# Altium schematic sheet Core.SchDoc
size A3; SheetNumber: 1; SheetTotal: 4
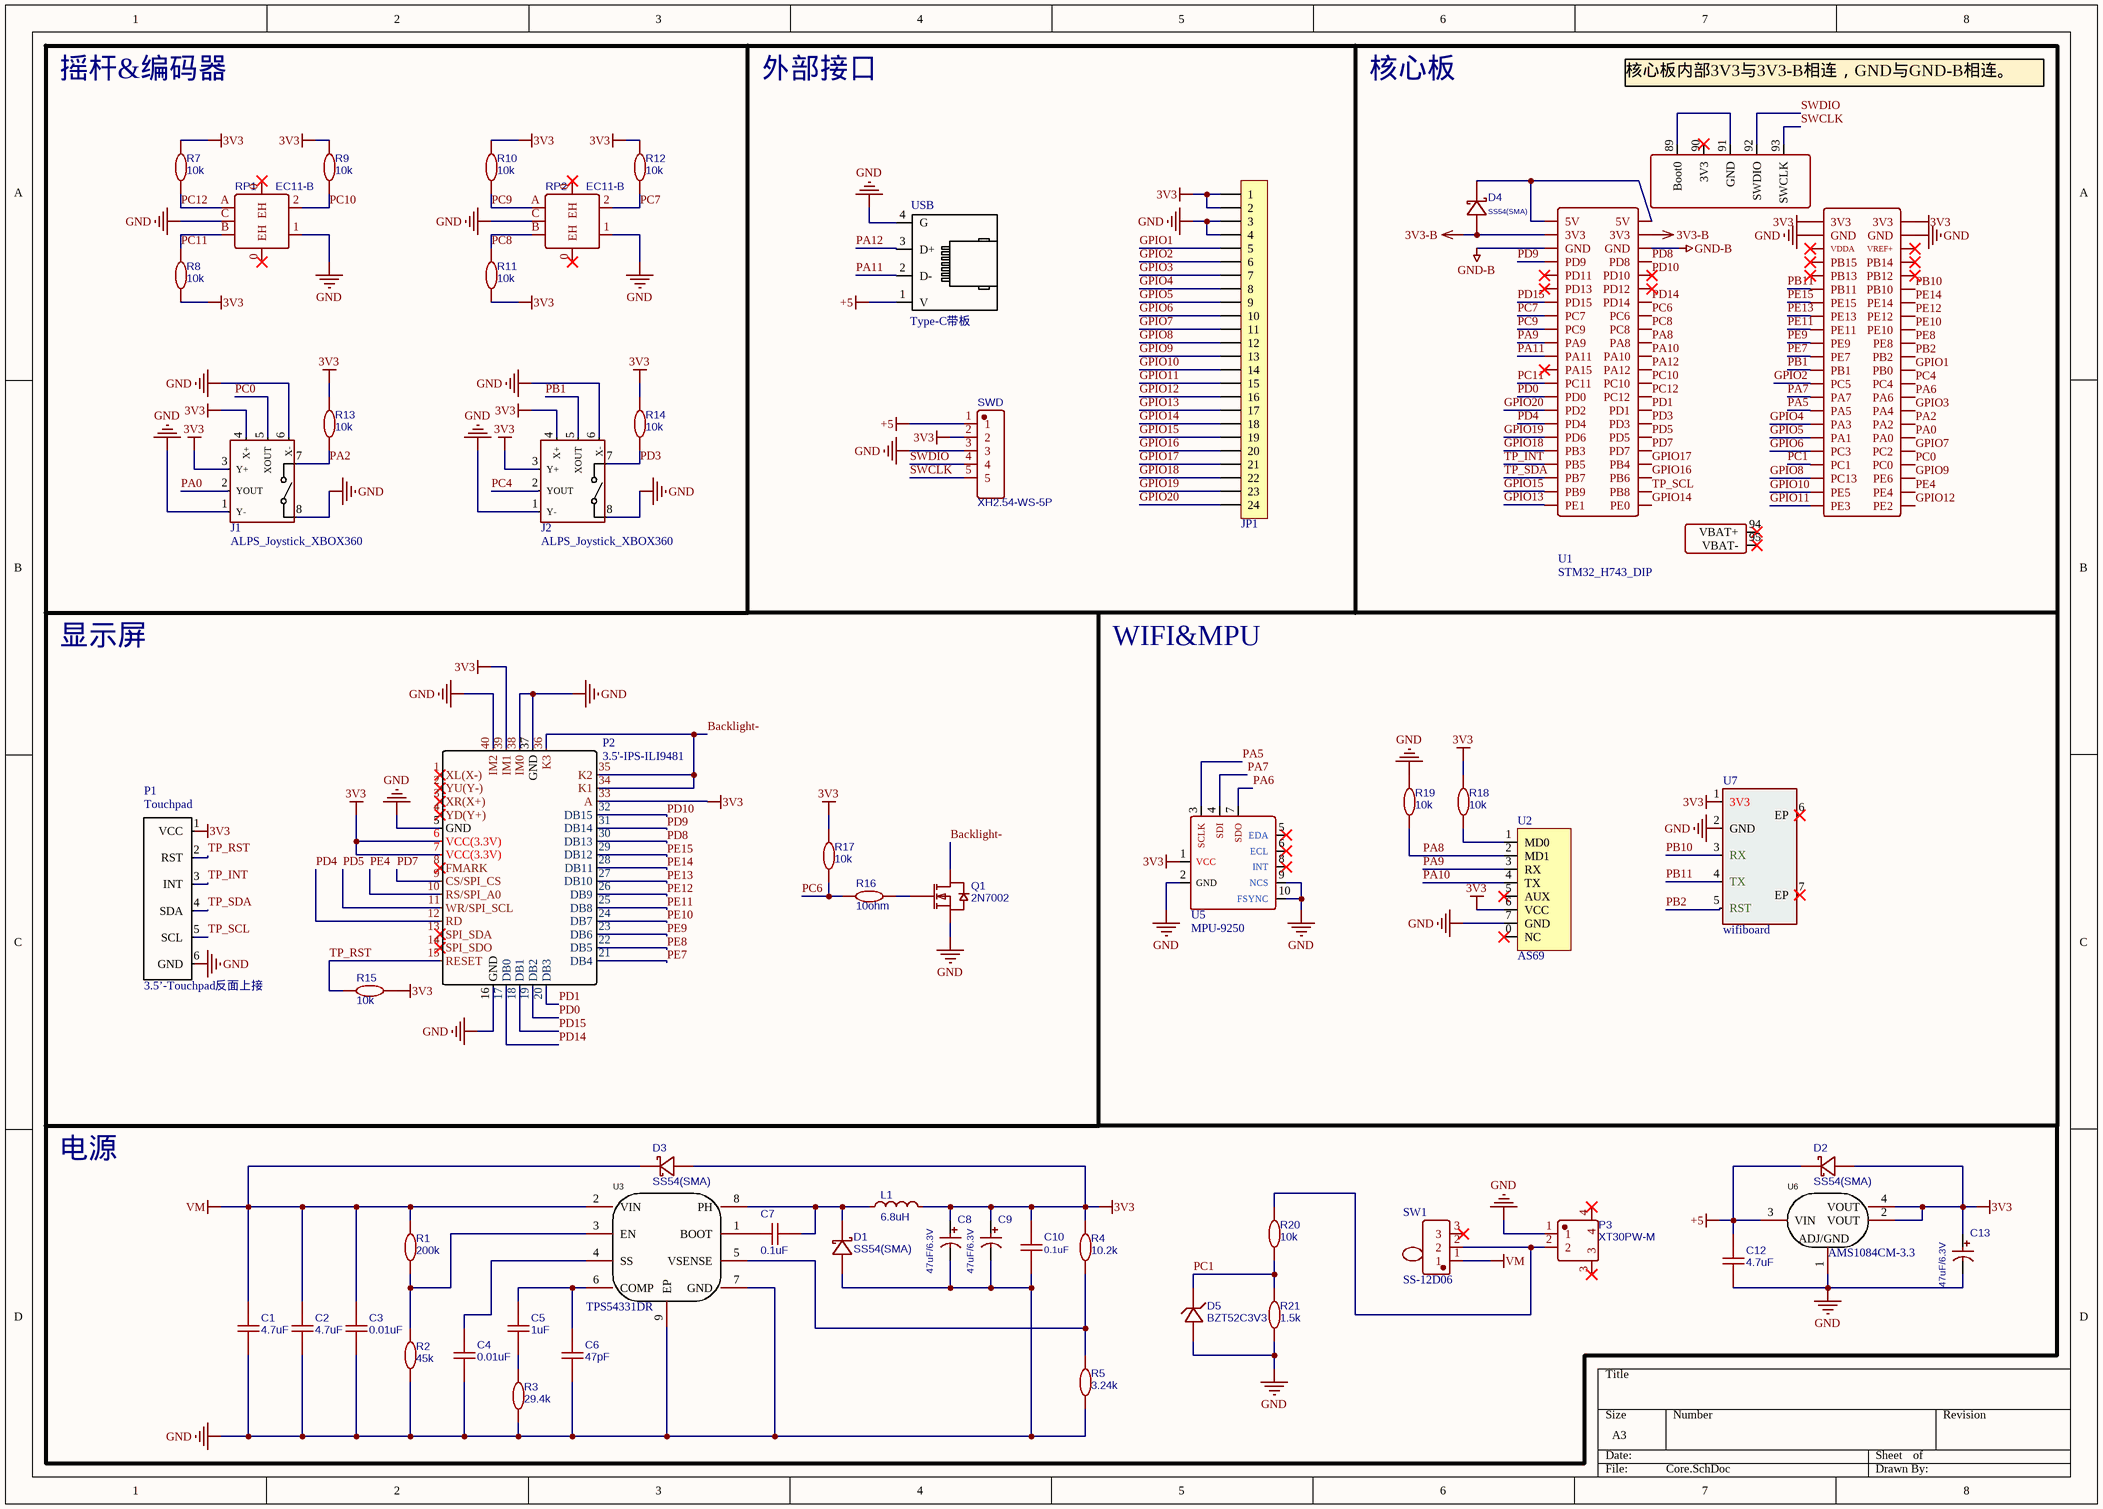
[diagram p0: Core.SchDoc]

## Parts
C1  4.7uF  [C0805]
C2  4.7uF  [C0805]
C3  0.01uF  [C0603]
C4  0.01uF  [C0603]
C5  1uF  [C0603]
C6  47pF  [C0603]
C7  0.1uF  [C0603]
C8  47uF/6.3V  [CD A(3216)]
C9  47uF/6.3V  [CD A(3216)]
C10  0.1uF  [C0603]
C12  4.7uF  [C0805]
C13  47uF/6.3V  [CD A(3216)]
D1  SS54(SMA)  [SMA]
D2  SS54(SMA)  [SMA]
D3  SS54(SMA)  [SMA]
D4  SS54(SMA)  [SMA]
D5  BZT52C3V3  [SOD-123]
J1  ALPS_Joystick_XBOX360  [ALPS_Joystick_XBOX360]
J2  ALPS_Joystick_XBOX360  [ALPS_Joystick_XBOX360]
JP1  FPC1.0-24P  [FPC1.0-2H-WS-24P]  (value not drawn)
L1  6.8uH  [IND-SMD_L4.9-W4.4_MAPM0420F]
P1  3.5’-Touchpad反面上接  [3.5‘-Touchpad反面上接]
P2  3.5'-IPS-ILI9481  [3.5'-IPS-ILI9481反面上接]
P3  XT30PW-M  [CONN-TH_XT30PW-M]
Q1  2N7002  [SOT-23-3_L2.9-W1.3-P0.95-LS2.4-BR]
R1  200k  [R0603]
R2  45k  [R0603]
R3  29.4k  [R0603]
R4  10.2k  [R0603]
R5  3.24k  [R0603]
R7  10k  [R0603]
R8  10k  [R0603]
R9  10k  [R0603]
R10  10k  [R0603]
R11  10k  [R0603]
R12  10k  [R0603]
R13  10k  [R0603]
R14  10k  [R0603]
R15  10k  [R0603]
R16  10ohm  [R0603]
R17  10k  [R0603]
R18  10k  [R0603]
R19  10k  [R0603]
R20  10k  [R0603]
R21  1.5k  [R0603]
RP1  EC11-B  [EC11-B]
RP2  EC11-B  [EC11-B]
SW1  SS-12D06  [SS-12D06]
SWD  XH2.54-WS-5P  [XH2.54-WS-5P]
U1  STM32_H743_DIP  [STM32_H743_DIP]
U2  AS69  [AS69]
U3  TPS54331DR  [SOIC-8(with PowerPad)]
U5  MPU-9250  [MPU-9250]
U6  AMS1084CM-3.3  [TO-263-3L_L10.2-W8.7-P2.54-LS15.3-BL]
U7  wifiboard  [wifiboard]
USB  Type-C带板  [Type-C母头带板]

## Nets
3V3: C8.1 C9.1 C10.1 C13.1 D2.1(A) D3.1(A) J1.3(Y+) J1.4(X+) J2.3(Y+) J2.4(X+) JP1.1 JP1.2 L1.2 P1.1(VCC) P2.6(VCC(3.3V)) P2.7(VCC(3.3V)) P2.33(A) P2.39(IM1) R4.2 R7.1 R8.2 R9.1 R10.1 R11.2 R12.1 R13.1 R14.1 R15.2 R17.1 R18.1 SWD.2 U1.45(3V3) U1.46(3V3) U2.6(VCC) U5.1(VCC) U6.2(VOUT) U6.4(VOUT) U7.1(3V3)
3V3-B: D4.1(A) U1.3(3V3) U1.4(3V3)
+5: C12.2 D2.2(K) SWD.1 U6.3(VIN) USB.1(V)
GND: C1.1 C2.1 C3.1 C4.1 C6.1 C8.2 C9.2 C10.2 C12.1 C13.2 D1.1(A) D5.1(A) J1.1(Y-) J1.6(X-) J1.8(K2) J2.1(Y-) J2.6(X-) J2.8(K2) JP1.3 JP1.4 P1.6(GND) P2.5(GND) P2.16(GND) P2.37(GND) P2.38(IM0) P2.40(IM2) P3.1 Q1.2(S) R2.1 R3.1 R5.1 R19.1 R21.2 RP1.1 RP1.C RP2.1 RP2.C SWD.3 U1.47(GND) U1.48(GND) U2.7(GND) U3.7(GND) U3.9(EP) U5.2(GND) U5.9(NCS) U5.10(FSYNC) U6.1(ADJ/GND) U7.2(GND) USB.4(G)
GND-B: U1.5(GND) U1.6(GND)
VM: C1.2 C2.2 C3.2 D3.2(K) R1.1 SW1.1 U3.2(VIN)
Backlight-: P2.34(K1) P2.35(K2) P2.36(K3) Q1.3(D)
GPIO1: JP1.5 U1.68(PB0)
GPIO2: JP1.6 U1.69(PC5)
GPIO3: JP1.7 U1.74(PA4)
GPIO4: JP1.8 U1.75(PA3)
GPIO5: JP1.9 U1.77(PA1)
GPIO6: JP1.10 U1.79(PC3)
GPIO7: JP1.11 U1.80(PC2)
GPIO8: JP1.12 U1.83(PC13)
GPIO9: JP1.13 U1.84(PE6)
GPIO10: JP1.14 U1.85(PE5)
GPIO11: JP1.15 U1.87(PE3)
GPIO12: JP1.16 U1.88(PE2)
GPIO13: JP1.17 U1.43(PE1)
GPIO14: JP1.18 U1.44(PE0)
GPIO15: JP1.19 U1.41(PB9)
GPIO16: JP1.20 U1.40(PB6)
GPIO17: JP1.21 U1.38(PB4)
GPIO18: JP1.22 U1.35(PB3)
GPIO19: JP1.23 U1.33(PD6)
GPIO20: JP1.24 U1.29(PD2)
PA0: J1.2(YOUT) U1.78(PA0)
PA2: J1.7(K1) R13.2 U1.76(PA2)
PA5: U1.73(PA5) U5.3(SCLK)
PA6: U1.72(PA6) U5.7(SDO)
PA7: U1.71(PA7) U5.4(SDI)
PA8: R19.2 U1.20(PA8) U2.2(MD1)
PA9: U1.19(PA9) U2.3(RX)
PA10: U1.22(PA10) U2.4(TX)
PA11: U1.21(PA11) USB.2(D-)
PA12: U1.24(PA12) USB.3(D+)
PB1: J2.5(XOUT) U1.67(PB1)
PB2: U1.66(PB2) U7.5(RST)
PB10: U1.56(PB10) U7.3(RX)
PB11: U1.55(PB11) U7.4(TX)
PC0: J1.5(XOUT) U1.82(PC0)
PC1: D5.2(C) R20.2 R21.1 U1.81(PC1)
PC4: J2.2(YOUT) U1.70(PC4)
PC6: R16.1 R17.2 U1.16(PC6)
PC7: R12.2 RP2.2 U1.15(PC7)
PC8: R11.1 RP2.B U1.18(PC8)
PC9: R10.2 RP2.A U1.17(PC9)
PC10: R9.2 RP1.2 U1.26(PC10)
PC11: R8.1 RP1.B U1.25(PC11)
PC12: R7.2 RP1.A U1.28(PC12)
PD0: P2.19(DB2) U1.27(PD0)
PD1: P2.20(DB3) U1.30(PD1)
PD3: J2.7(K1) R14.2 U1.32(PD3)
PD4: P2.12(RD) U1.31(PD4)
PD5: P2.11(WR/SPI_SCL) U1.34(PD5)
PD7: P2.9(CS/SPI_CS) U1.36(PD7)
PD8: P2.30(DB13) U1.8(PD8)
PD9: P2.31(DB14) U1.7(PD9)
PD10: P2.32(DB15) U1.10(PD10)
PD14: P2.17(DB0) U1.14(PD14)
PD15: P2.18(DB1) U1.13(PD15)
PE4: P2.10(RS/SPI_A0) U1.86(PE4)
PE7: P2.21(DB4) U1.65(PE7)
PE8: P2.22(DB5) U1.64(PE8)
PE9: P2.23(DB6) U1.63(PE9)
PE10: P2.24(DB7) U1.62(PE10)
PE11: P2.25(DB8) U1.61(PE11)
PE12: P2.26(DB9) U1.60(PE12)
PE13: P2.27(DB10) U1.59(PE13)
PE14: P2.28(DB11) U1.58(PE14)
PE15: P2.29(DB12) U1.57(PE15)
SWCLK: SWD.5 U1.93(SWCLK)
SWDIO: SWD.4 U1.92(SWDIO)
TP_INT: P1.3(INT) U1.37(PB5)
TP_RST: P1.2(RST) P2.15(RESET) R15.1
TP_SCL: P1.5(SCL) U1.42(PB8)
TP_SDA: P1.4(SDA) U1.39(PB7)
NetC4_2: C4.2 U3.4(SS)
NetC5_1: C5.1 R3.2
NetC5_2: C5.2 C6.2 U3.6(COMP)
NetC7_1: C7.1 D1.2(K) L1.1 U3.8(PH)
NetC7_2: C7.2 U3.1(BOOT)
NetD4_2: D4.2(K) U1.1(5V) U1.2(5V)
NetP3_2: P3.2 R20.1 SW1.2
NetQ1_1: Q1.1(G) R16.2
NetR1_2: R1.2 R2.2 U3.3(EN)
NetR4_1: R4.1 R5.2 U3.5(VSENSE)
NetR18_2: R18.2 U2.1(MD0)
NetU1_89: U1.89(Boot0) U1.91(GND)

Not connected (* = marked no-connect by the designer): P2 1(XL(X-))* 2(YU(Y-))* 3(XR(X+))* 4(YD(Y+))* 8(FMARK)* 13(SPI_SDA)* 14(SPI_SDO)*; P3 3* 4*; RP1 0(EH)*; RP2 0(EH)*; SW1 3*; U1 9(PD11)* 11(PD13)* 12(PD12)* 23(PA15)* 49(VDDA)* 50(VREF+)* 51(PB15)* 52(PB14)* 53(PB13)* 54(PB12)* 90(3V3)* 94(VBAT+)* 95(VBAT-)*; U2 0(NC)* 5(AUX)*; U5 5(EDA)* 6(ECL)* 8(INT)*; U7 6(EP)* 7(EP)*

## Notes on the sheet
- 摇杆&编码器
- 外部接口
- 核心板
- 核心板内部3V3与3V3-B相连，GND与GND-B相连。
- 显示屏
- WIFI&MPU
- 电源
- (in symbol 3.5’-Touchpad反面上接) Touchpad

## Library data of the parts
C1 C2 C12 = C0805: BOM_Manufacturer: 火炬; BOM_Manufacturer Part: C0805B104K500NT; nameAlias: Capacitance; Contributor: LCSC; BOM_Supplier: LCSC; BOM_Supplier Part: C476766; BOM_JLCPCB Part Class: Extended Part; spicePre: C; spiceSymbolName: C0805B104K500NT
C3-C7 C10 = C0603: BOM_Manufacturer: YAGEO; BOM_Manufacturer Part: CC0603KRX7R9BB104; nameAlias: Capacitance; BOM_Supplier: LCSC; BOM_Supplier Part: C14663; BOM_JLCPCB Part Class: Basic Part; spicePre: C; spiceSymbolName: CC0603KRX7R9BB104
C8 C9 C13 = A型钽电容: 长3.2mm，宽1.6mm，厚1.6mm; BOM_Manufacturer: ValuePro; BOM_Manufacturer Part: 50V 100uF 8X12; nameAlias: Capacitance; BOM_Supplier: LCSC; BOM_Supplier Part: C2749; BOM_JLCPCB Part Class: Extended Part; spicePre: C; spiceSymbolName: 50V 100uF 8X12
D1-D4 = SS54(SMA): BOM_Manufacturer: Doeshare(德芯); BOM_Manufacturer Part: SS34; Contributor: LCSC; BOM_Supplier: LCSC; BOM_Supplier Part: C2931787; BOM_JLCPCB Part Class: Extended Part; spicePre: D; spiceSymbolName: SS34_C2931787
D5 = BZT52C3V3: BOM_Manufacturer: Shandong Jingdao Microelectronics; Contributor: LCSC; BOM_Supplier: LCSC; BOM_Supplier Part: C353528; BOM_Manufacturer Part: BZT52C3V3; BOM_JLCPCB Part Class: Extended Part; spicePre: D; spiceSymbolName: BZT52C3V3_C353528
JP1 = FPC-24P-1.0: FPC连接器; 版权归属: 黎明电子style; BOM名称: FPC连接器; 学习资源: https://lmdzstyle.taobao.com/
L1 = 0420功率电感: BOM_Manufacturer: FH(风华); BOM_Manufacturer Part: HA42-4R7MT; nameAlias: Inductance; Contributor: LCSC; BOM_Supplier: LCSC; BOM_Supplier Part: C2936653; BOM_JLCPCB Part Class: Extended Part; spicePre: L; spiceSymbolName: HA42-4R7MT
P2 = 3.5'-IPS-ILI9481反面上接
P3 = XT30PW-M: BOM_Manufacturer: Changzhou Amass Elec; Contributor: LCSC; BOM_Supplier: LCSC; BOM_Supplier Part: C431092; BOM_Manufacturer Part: XT30PW-M; BOM_JLCPCB Part Class: Extended Part; spicePre: C; spiceSymbolName: XT30PW-M
Q1 = 2N7002: BOM_Manufacturer: CJ; BOM_Supplier: LCSC; BOM_Manufacturer Part: 2N7002; BOM_Supplier Part: C8545; BOM_JLCPCB Part Class: Basic Part; spicePre: Q; spiceSymbolName: 2N7002
R1-R5 R7-R21 = R0603: BOM_Manufacturer: YAGEO; BOM_Manufacturer Part: SR0603JR-071RL; nameAlias: Resistance (Ohms); Contributor: LCSC; Resistance: 1Ω; BOM_Supplier: LCSC; BOM_Supplier Part: C326890; BOM_JLCPCB Part Class: Extended Part; spicePre: R; spiceSymbolName: SR0603JR-071RL
RP1 RP2 = EC11-B: 数字开关编码器; BOM_Manufacturer: Chengdu Guosheng Tech; BOM_Manufacturer Part: 3006P-1-102; Resistance(Ohms): 1K; nameAlias: Resistance; Contributor: LCSC; BOM_Supplier: LCSC; BOM_Supplier Part: C118948; Resistance (Ohms): 1K; BOM_JLCPCB Part Class: Extended Part; spicePre: R; spiceSymbolName: 3006P-1-102
SW1 = SS-12D06: 卧式三脚拨动开关
SWD = XH2.54-WS-5P: 贴片卧式XH接头; BOM_Manufacturer: kinghelm(金航标); BOM_Manufacturer Part: KH-2.54PH90-1X18P-L13.8; Contributor: LCSC; BOM_Supplier: LCSC; BOM_Supplier Part: C2905432; spicePre: H; spiceSymbolName: KH-2.54PH90-1X18P-L13.8
U2 = AS69: 常用串口模块
U3 = TPS54331DR: 28V输入3A电流DCDC芯片; Manufacturer: TI(德州仪器); Add into BOM: yes; Function: 降压型; Name: TPS54331DR; Symbol: TPS54331DR; Device: TPS54331DR; LCSC Part Name: 降压型; Supplier Part: C9865; Manufacturer Part: TPS54331DR; Supplier Footprint: SOIC-8_150mil; JLCPCB Part Class: Basic Part; Datasheet: https://atta.szlcsc.com/upload/public/pdf/source/20121112/1457706556448.pdf; Supplier: LCSC; Convert to PCB: yes; Synchronous Rectification: -; Number of Outputs: -; Topology: -; Input Voltage: -; Output Current (Max): -; Switching Frequency: -
U6 = AMS1084CM-3.3: 3.3V 5A; Manufacturer: UMW(广东友台半导体); Add into BOM: yes; Name: AMS1084CM-3.3; Symbol: AMS1084CM-3.3; Device: AMS1084CM-3.3; LCSC Part Name: AMS1084CM-3.3; Supplier Part: C347301; Manufacturer Part: AMS1084CM-3.3; Supplier Footprint: TO-263-3L; JLCPCB Part Class: Extended Part; Datasheet: https://atta.szlcsc.com/upload/public/pdf/source/20211011/4F7061ADBB516DA54D1BBE73493E6007.pdf; Supplier: LCSC; Convert to PCB: yes; Output Type: -